# EAGLE design working (EAGLE 6.5.0)
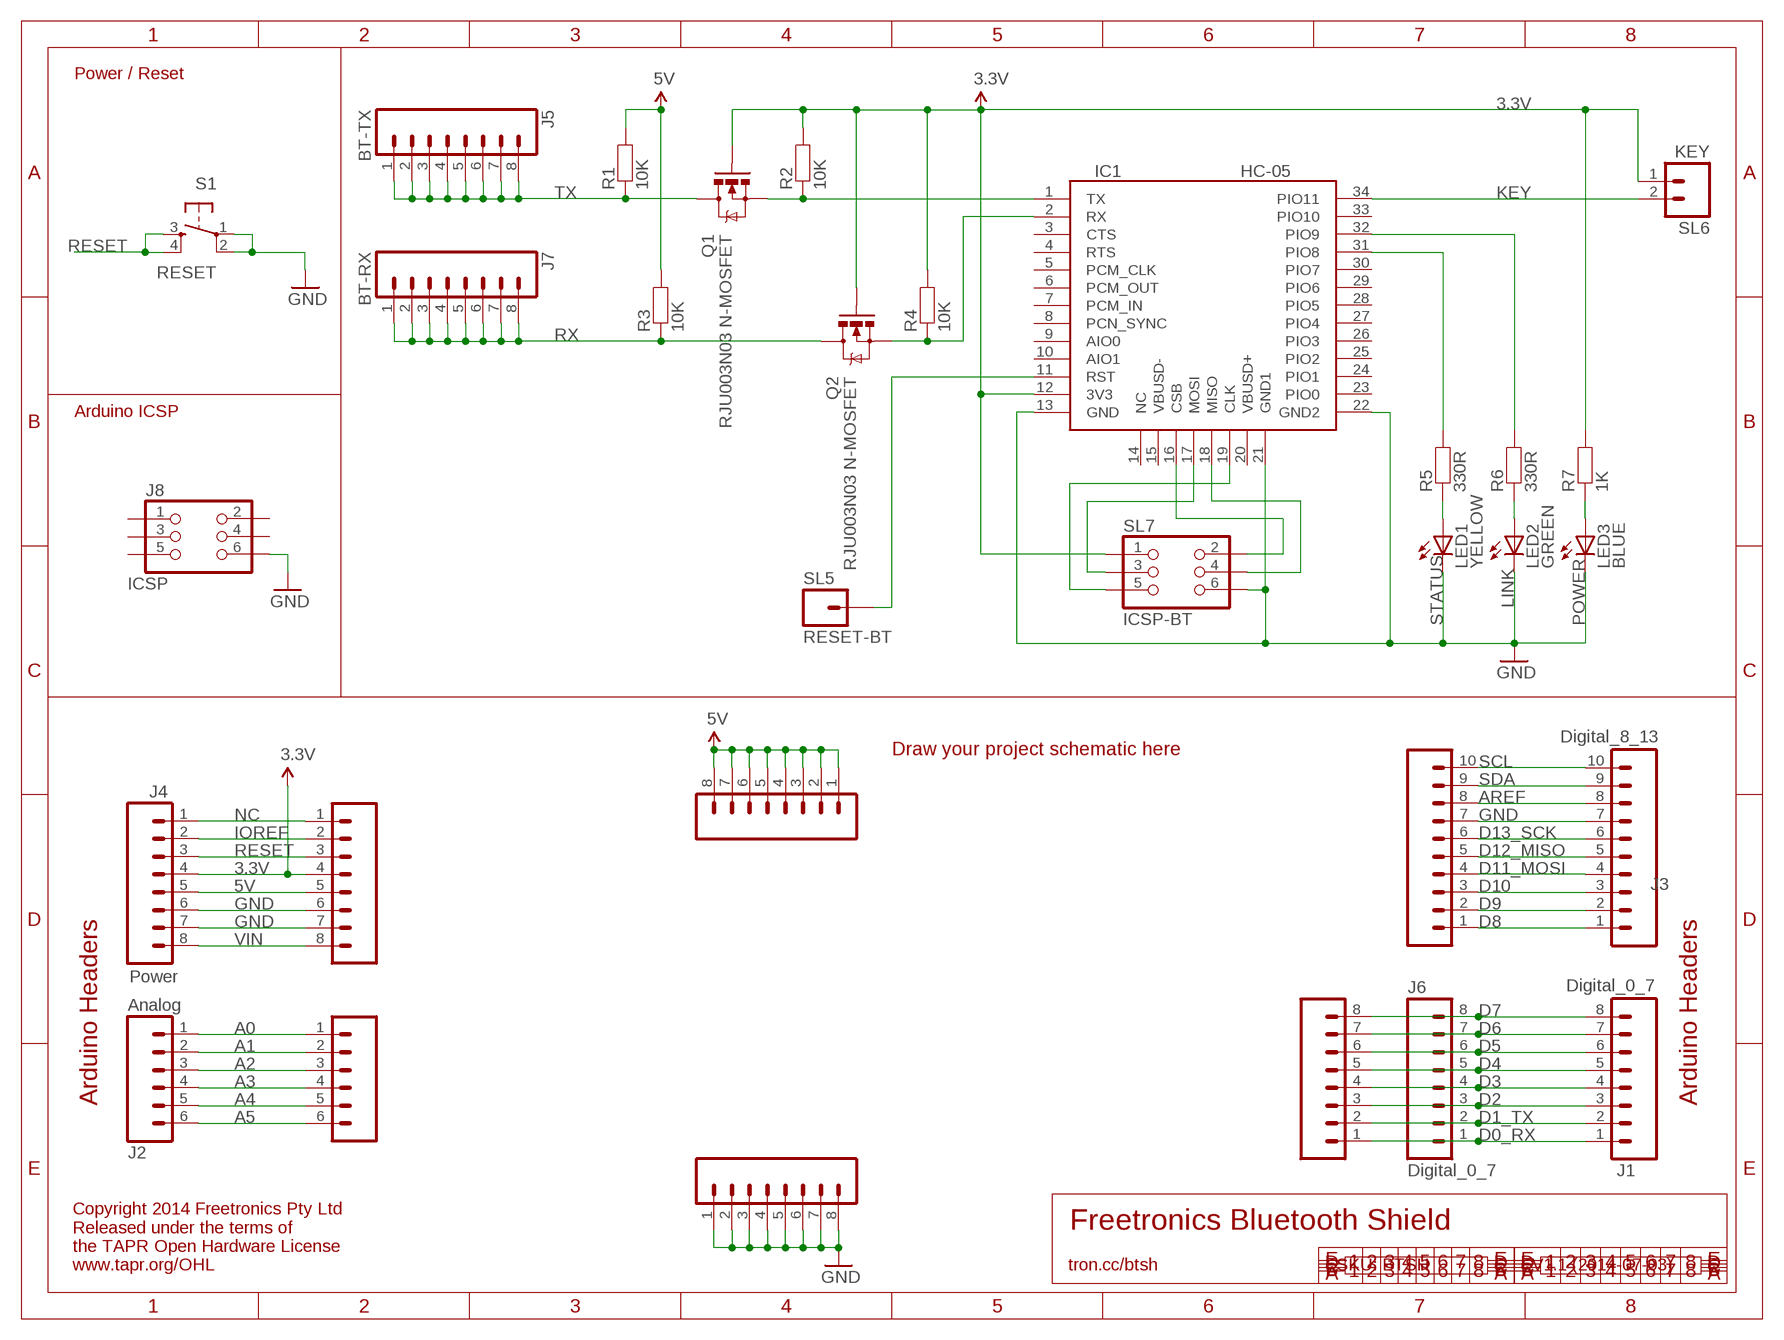
[diagram p0: schematic, sheet 1]

## Parts
IC1  HC-05  HC_05  [BLUETOOTH_SMD]
J1  Digital_0_7  M08  [1X08]
J2  Analog  M06SIP  [1X06]
J3  Digital_8_13  M100.1  [1X10]
J4  Power  M08  [1X08]
J5  BT-TX  M08  [1X08]
J6  Digital_0_7  M08  [1X08]
J7  BT-RX  M08  [1X08]
J8  ICSP  ICSPPTH  [2X03PTH]
LED1  YELLOW  LED0603  [LED-0603]
LED2  GREEN  LED0603  [LED-0603]
LED3  BLUE  LED0603  [LED-0603]
Q1  RJU003N03 N-MOSFET  MOSFET-NSOT-323  [SOT32-3]
Q2  RJU003N03 N-MOSFET  MOSFET-NSOT-323  [SOT32-3]
R1  10K  RESISTOR0603  [0603]
R2  10K  RESISTOR0603  [0603]
R3  10K  RESISTOR0603  [0603]
R4  10K  RESISTOR0603  [0603]
R5  330R  RESISTOR0603  [0603]
R6  330R  RESISTOR0603  [0603]
R7  1K  RESISTOR0603  [0603]
S1  RESET  TAC_SWITCHSMD  [TACTILE_SWITCH_SMD]
SL1  Digital_0_7  M08  [1X08]
SL2  Analog  M06SIP  [1X06]
SL3  Digital_8_13  M100.1  [1X10]
SL4  Power  M08  [1X08]
SL5  RESET-BT  M01PTH  [1X01]
SL6  KEY  M02PTH  [1X02]
SL7  ICSP-BT  ICSPPTH  [2X03PTH]
SL8  5V  M08  [1X08]
SL9  GND  M08  [1X08]

## Nets
3.3V: IC1.12(3V3) J4.4 Q1.1(G) Q2.1(G) R2.2 R4.2 R7.2 SL4.4 SL6.1 SL7.1
5V: J4.5 R1.2 R3.2 SL4.5 SL8.1 SL8.2 SL8.3 SL8.4 SL8.5 SL8.6 SL8.7 SL8.8
A0: J2.1 SL2.1
A1: J2.2 SL2.2
A2: J2.3 SL2.3
A3: J2.4 SL2.4
A4: J2.5 SL2.5
A5: J2.6 SL2.6
AREF: J3.8 SL3.8
D0_RX: J1.1 J6.1 SL1.1
D1_TX: J1.2 J6.2 SL1.2
D2: J1.3 J6.3 SL1.3
D3: J1.4 J6.4 SL1.4
D4: J1.5 J6.5 SL1.5
D5: J1.6 J6.6 SL1.6
D6: J1.7 J6.7 SL1.7
D7: J1.8 J6.8 SL1.8
D8: J3.1 SL3.1
D9: J3.2 SL3.2
D10: J3.3 SL3.3
D11_MOSI: J3.4 SL3.4
D12_MISO: J3.5 SL3.5
D13_SCK: J3.6 SL3.6
GND: IC1.13(GND) IC1.21(GND1) IC1.22(GND2) J3.7 J4.6 J4.7 J8.6 LED1.C LED2.C LED3.C S1.1 S1.2 SL3.7 SL4.6 SL4.7 SL7.6 SL9.1 SL9.2 SL9.3 SL9.4 SL9.5 SL9.6 SL9.7 SL9.8
IOREF: J4.2 SL4.2
KEY: IC1.34(PIO11) SL6.2
N$1: LED1.A R5.1
N$2: LED2.A R6.1
N$3: IC1.16(CSB) SL7.2
N$4: IC1.31(PIO8) R5.2
N$6: IC1.32(PIO9) R6.2
N$14: LED3.A R7.1
N$17: IC1.11(RST) SL5.1
N$21: IC1.17(MOSI) SL7.3
N$37: IC1.18(MISO) SL7.4
N$44: IC1.1(TX) Q1.2(S) R2.1
N$45: IC1.2(RX) Q2.2(S) R4.1
N$46: IC1.19(CLK) SL7.5
NC: J4.1 SL4.1
RESET: J4.3 S1.3 S1.4 SL4.3
RX: J7.1 J7.2 J7.3 J7.4 J7.5 J7.6 J7.7 J7.8 Q2.3(D) R3.1
SCL: J3.10 SL3.10
SDA: J3.9 SL3.9
TX: J5.1 J5.2 J5.3 J5.4 J5.5 J5.6 J5.7 J5.8 Q1.3(D) R1.1
VIN: J4.8 SL4.8
Unconnected: IC1.3(CTS) IC1.4(RTS) IC1.5(PCM_CLK) IC1.6(PCM_OUT) IC1.7(PCM_IN) IC1.8(PCN_SYNC) IC1.9(AIO0) IC1.10(AIO1) IC1.14(NC) IC1.15(VBUSD-) IC1.20(VBUSD+) IC1.23(PIO0) IC1.24(PIO1) IC1.25(PIO2) IC1.26(PIO3) IC1.27(PIO4) IC1.28(PIO5) IC1.29(PIO6) IC1.30(PIO7) IC1.33(PIO10) J8.1 J8.2 J8.3 J8.4 J8.5

## Notes on the sheet
- Power / Reset
- Arduino ICSP
- LINK
- STATUS | POWER
- Draw your project schematic here
- Arduino Headers | Arduino Headers
- Freetronics Bluetooth Shield
- Copyright 2014 Freetronics Pty Ltd
  Released under the terms of
  the TAPR Open Hardware License
  www.tapr.org/OHL
- tron.cc/btsh | SKU: BTSH | V1.1 (2014-07-03)

## Library data of the parts
IC1 = freetronics-jon:HC_05
J1 J4 SL1 SL4 SL8 SL9 = freetronics:M08: Header 8 Standard 8-pin 0.1" header. Use with straight break away headers (SKU : PRT-00116), right angle break away headers (PRT-00553), swiss pins (PRT-00743), machine pins (PRT-00117), and female headers (PRT-00115).
J2 SL2 = freetronics:M06: Header 6 Standard 6-pin 0.1" header. Use with straight break away headers (SKU : PRT-00116), right angle break away headers (PRT-00553), swiss pins (PRT-00743), machine pins (PRT-00117), and female headers (PRT-00115). Molex polarized connector foot print use with SKU : PRT-08094 with associated crimp pins and housings. NOTES ON THE VARIANTS LOCK and LOCK_LONGPADS... This footprint was designed to help hold the alignment of a through-hole component (i.e. 6-pin header) while soldering it into place. You may notice that each hole has been shifted either up or down by 0.005 of an inch from it's more standard position (which is a perfectly straight line). This slight alteration caused the pins (the squares in the middle) to touch the edges of the holes. Because they are alternating, it causes a "brace" to hold the component in place. 0.005 has proven to be the perfect amount of "off-center" position when using our standard breakaway headers. Although looks a little odd when you look at the bare footprint, once you have a header in there, the alteration is very hard to notice. Also, if you push a header all the way into place, it is covered up entirely on the bottom side. This idea of altering the position of holes to aid alignment will be further integrated into the Sparkfun Library for other footprints. It can help hold any component with 3 or more connection pins.
J3 SL3 = freetronics-original:M10: Header 10 Standard 10-pin 0.1" header. Use with straight break away headers (SKU : PRT-00116), right angle break away headers (PRT-00553), swiss pins (PRT-00743), machine pins (PRT-00117), and female headers (PRT-00115).
J5-J7 = freetronics-original:M08: Header 8 Standard 8-pin 0.1" header. Use with straight break away headers (SKU : PRT-00116), right angle break away headers (PRT-00553), swiss pins (PRT-00743), machine pins (PRT-00117), and female headers (PRT-00115).
J8 SL7 = freetronics-jon:ICSP
LED1-LED3 = freetronics-jon:LED: LEDs Standard schematic elements and footprints for 5mm, 3mm, 1206, and 0603 sized LEDs. 5mm - Spark Fun Electronics SKU : COM-00529 (and others)
Q1 Q2 = freetronics-jon:MOSFET-N: Basic N-Channel MOSFET
R1-R7 = freetronics-jon:RESISTOR: Resistor Basic schematic elements and footprints for 0603, 1206, and PTH 1/10th watt (small) resistors.
S1 = freetronics-original:TAC_SWITCH: Momentary Switch Button commonly used for reset or general input. Spark Fun Electronics SKU : COM-00097
SL5 = freetronics-master-v1.1:M01: Header 1 Standard 1-pin 0.1" header. Use with straight break away headers (SKU : PRT-00116), right angle break away headers (PRT-00553), swiss pins (PRT-00743), machine pins (PRT-00117), and female headers (PRT-00115).
SL6 = freetronics-master-v1.1:M02: Header 2 Standard 2-pin 0.1" header. Use with straight break away headers (SKU : PRT-00116), right angle break away headers (PRT-00553), swiss pins (PRT-00743), machine pins (PRT-00117), and female headers (PRT-00115). Molex polarized connector foot print use with SKU : PRT-08233 with associated crimp pins and housings.

## Board
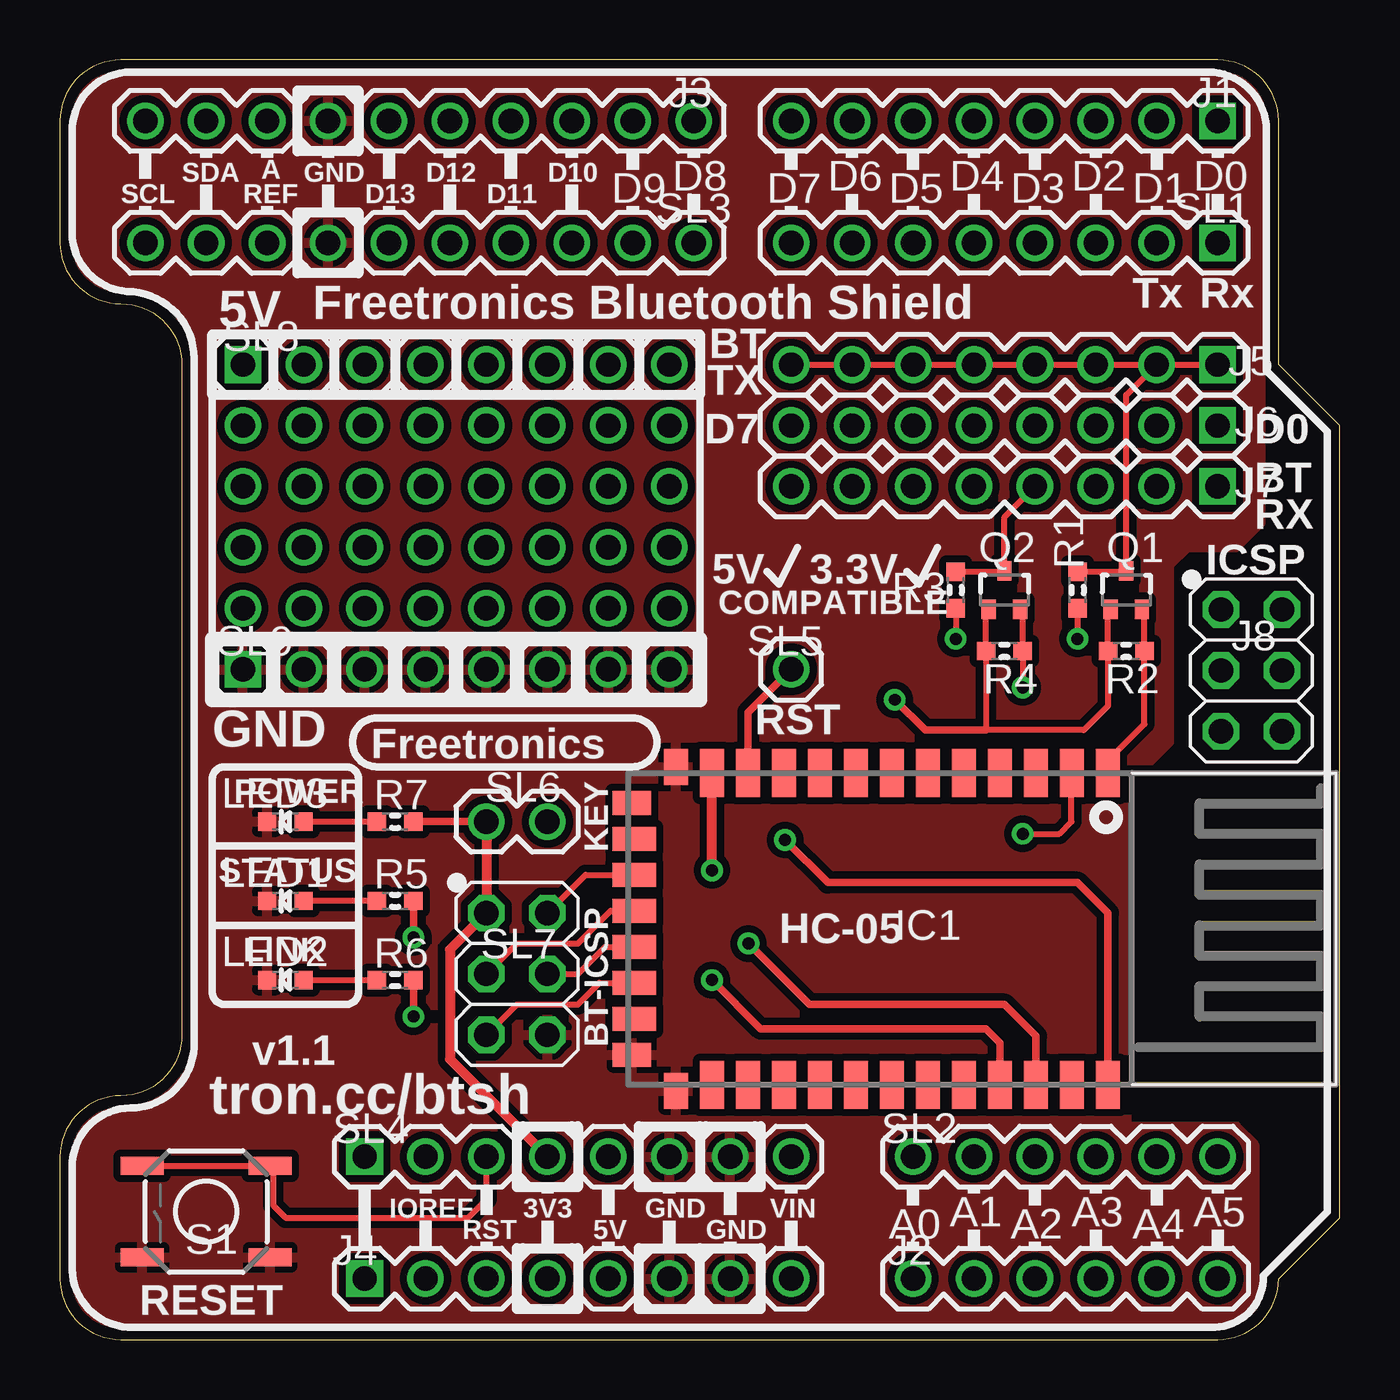
[diagram p1: board, top side]
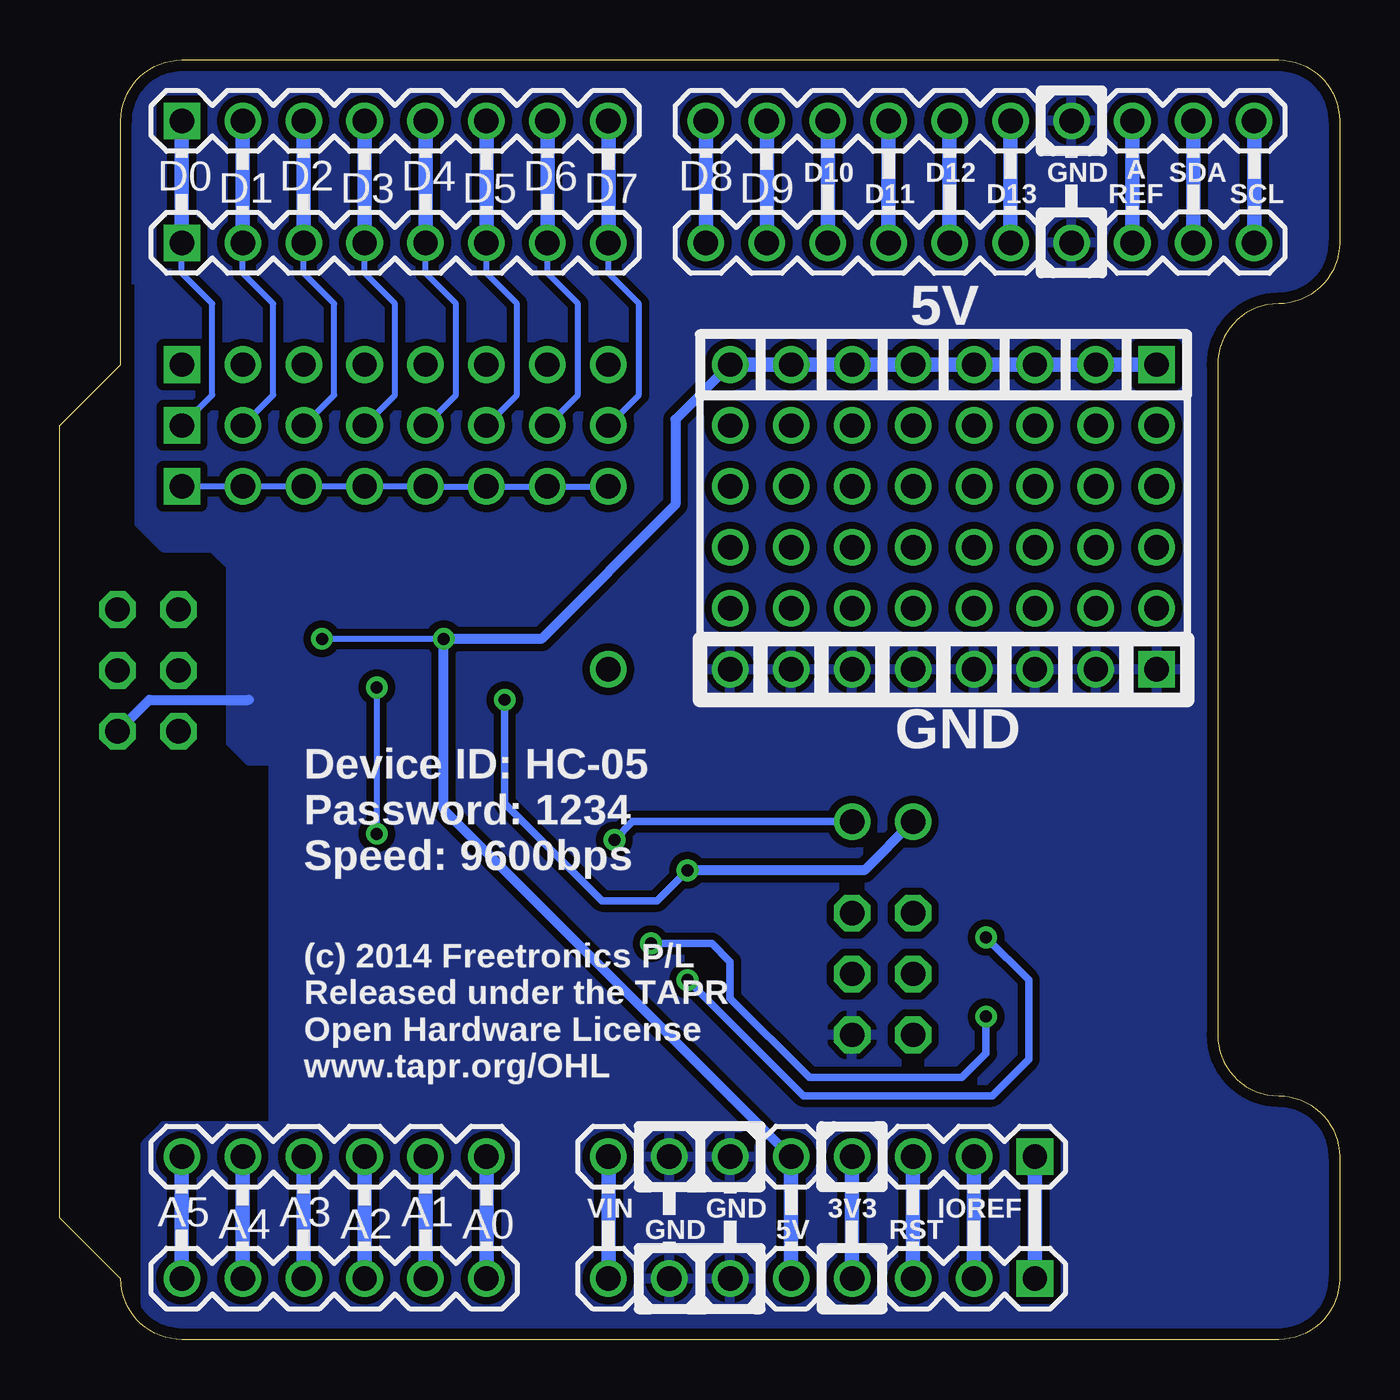
[diagram p2: board, bottom side, seen from below]

Size 53.34 x 53.34 mm. Coordinates in mm from the lower left corner, seen from the top.
Outline: 0,2.54 arc90 2.54,0 48.26,0 arc90 50.8,2.54 53.34,5.08 53.34,38.1 50.8,40.64 50.8,50.8 arc90 48.26,53.34 2.54,53.34 arc90 0,50.8 0,45.72 arc90 2.54,43.18 arc-90 5.08,40.64 5.08,12.7 arc-90 2.54,10.16 arc90 0,7.62 0,2.54
Copper layers (1*16): Top 0.035mm / dielectric 1.5mm / Bottom 0.035mm
Design rules "default *": minimum track width 10mil, minimum drill 24mil, track to track 12mil, track to pad 12mil, pad to pad 12mil, via to via 12mil, smd to smd 8mil, copper to edge 18mil, drill to drill 8mil, minimum pad ring 10mil, minimum via ring 8mil, stop-mask expansion 4mil, vias tented up to drill 0mil, thermal gap 10mil

### Footprints (pad centres in the part's own frame; a part is rotated, then mirrored left to right if it is on the bottom)
BLUETOOTH_SMD = smd 1 x 2: 1 -5.08,-6.35; 2 -3.58,-6.35; 3 -2.08,-6.35; 4 -0.58,-6.35; 5 0.92,-6.35; 6 2.42,-6.35; 7 3.92,-6.35; 8 5.42,-6.35; 9 6.92,-6.35; 10 8.42,-6.35; 11 9.92,-6.35; 12 11.42,-6.35; 23 11.42,6.65; 24 9.92,6.65; 25 8.42,6.65; 26 6.92,6.65; 27 5.42,6.65; 28 3.92,6.65; 29 2.42,6.65; 30 0.92,6.65; 31 -0.58,6.65; 32 -2.08,6.65; 33 -3.58,6.65; 34 -5.08,6.65 | smd 1 x 1.5: 13 12.92,-6.6; 22 12.92,6.9 | smd 1.6 x 1: 14 14.77,-5.1; 21 14.77,5.4 | smd 1.8 x 1: 15 14.67,-3.6; 16 14.67,-2.1; 17 14.67,-0.6; 18 14.67,0.9; 19 14.67,2.4; 20 14.67,3.9
1X08 = drill 1.016 square: 1 0,0 | drill 1.016: 2 2.54,0; 3 5.08,0; 4 7.62,0; 5 10.16,0; 6 12.7,0; 7 15.24,0; 8 17.78,0
1X06 = drill 1.016: 1 0,0; 2 2.54,0; 3 5.08,0; 4 7.62,0; 5 10.16,0; 6 12.7,0
1X10 = drill 1.016: 1 0,0; 2 2.54,0; 3 5.08,0; 4 7.62,0; 5 10.16,0; 6 12.7,0; 7 15.24,0; 8 17.78,0; 9 20.32,0; 10 22.86,0
2X03PTH = drill 1.016 octagon: 1 -2.54,-1.27; 2 -2.54,1.27; 3 0,-1.27; 4 0,1.27; 5 2.54,-1.27; 6 2.54,1.27
LED-0603 = smd 0.762 x 0.762: A -0.762,0; C 0.762,0
SOT32-3 = smd 0.6 x 0.8: 1 -0.65,-0.8; 2 0.65,-0.8; 3 0,0.8
0603 = smd 0.762 x 0.762: 1 -0.762,0; 2 0.762,0
TACTILE_SWITCH_SMD = smd 1.778 x 0.762: 1 -2.667,1.905; 2 2.667,1.905; 3 -2.667,-1.905; 4 2.667,-1.905
1X01 = drill 1.016: 1 0,0
1X02 = drill 1.016: 1 0,0; 2 2.54,0

### Placement (x,y rotation side)
IC1  38.61,17.27 180 top
J1  48.26,50.8 180 top
J2  35.56,2.54 0 top
J3  26.42,50.8 180 top
J4  12.7,2.54 0 top
J5  48.26,40.64 180 top
J6  48.26,38.1 180 top
J7  48.26,35.56 180 top
J8  49.67,27.89 270 top
LED1  9.4,18.29 180 top
LED2  9.4,14.99 180 top
LED3  9.4,21.59 180 top
Q1  44.45,31.24 0 top
Q2  39.37,31.24 0 top
R1  42.42,31.24 270 top
R2  44.45,28.7 180 top
R3  37.34,31.24 270 top
R4  39.37,28.7 180 top
R5  13.97,18.29 0 top
R6  13.97,14.99 0 top
R7  13.97,21.59 0 top
S1  6.1,5.33 180 top
SL1  48.26,45.72 180 top
SL2  35.56,7.62 0 top
SL3  26.42,45.72 180 top
SL4  12.7,7.62 0 top
SL5  30.48,27.94 0 top
SL6  17.78,21.59 0 top
SL7  19.05,15.24 270 top
SL8  7.62,40.64 0 top
SL9  7.62,27.94 0 top

### Tracks (layer width: path | path; a pad name or v marks a point on that pad's centre or on a via)
3.3V  (via drill 0.5)
  Top 0.254: Q1.1 43.69,30.33 R2.2 43.69,26.42 42.67,25.4 38.61,25.4 R4.2 38.61,30.33 Q2.1
  Top 0.305: R7.2 SL6.1 | 38.61,25.4 36.07,25.4 v34.8,26.67
  Top 0.406: SL6.1 SL7.1 16.26,16.26 16.26,11.68 SL4.4 | v27.18,19.56 v27.19,19.57 IC1.12
  Bottom 0.305: v34.8,26.67 34.8,22.35 30.73,18.29 28.45,18.29 v27.18,19.56
  Bottom 0.406: SL6.1 19.81,19.56 v27.18,19.56
  Bottom 0.61: SL4.4 J4.4
5V  (via drill 0.5)
  Top 0.254: R1.2 v42.42,29.21 | R3.2 v37.34,29.21
  Bottom 0.254: v37.34,29.21 v42.42,29.21
  Bottom 0.406: SL4.5 37.34,22.1 v37.34,29.21 33.27,29.21 27.69,34.8 27.69,38.35 SL8.8
  Bottom 0.61: J4.5 SL4.5 | SL8.1 SL8.2 SL8.3 SL8.4 SL8.5 SL8.6 SL8.7 SL8.8
A0
  Bottom 0.61: J2.1 SL2.1
A1
  Bottom 0.61: J2.2 SL2.2
A2
  Bottom 0.61: J2.3 SL2.3
A3
  Bottom 0.61: J2.4 SL2.4
A4
  Bottom 0.61: J2.5 SL2.5
A5
  Bottom 0.61: J2.6 SL2.6
AREF
  Bottom 0.61: SL3.8 J3.8
D0_RX
  Bottom 0.254: J6.1 46.99,39.37 46.99,43.18 48.26,44.45 SL1.1
  Bottom 0.61: SL1.1 J1.1
D1_TX
  Bottom 0.254: J6.2 44.45,39.37 44.45,43.18 45.72,44.45 SL1.2
  Bottom 0.61: SL1.2 J1.2
D2
  Bottom 0.254: J6.3 41.91,39.37 41.91,43.18 43.18,44.45 SL1.3
  Bottom 0.61: SL1.3 J1.3
D3
  Bottom 0.254: J6.4 39.37,39.37 39.37,43.18 40.64,44.45 SL1.4
  Bottom 0.61: SL1.4 J1.4
D4
  Bottom 0.254: J6.5 36.83,39.37 36.83,43.18 38.1,44.45 SL1.5
  Bottom 0.61: SL1.5 J1.5
D5
  Bottom 0.254: J6.6 34.29,39.37 34.29,43.18 35.56,44.45 SL1.6
  Bottom 0.61: SL1.6 J1.6
D6
  Bottom 0.254: J6.7 31.75,39.37 31.75,43.18 33.02,44.45 SL1.7
  Bottom 0.61: SL1.7 J1.7
D7
  Bottom 0.254: J6.8 29.21,39.37 29.21,43.18 30.48,44.45 SL1.8
  Bottom 0.61: SL1.8 J1.8
D8
  Bottom 0.61: SL3.1 J3.1
D9
  Bottom 0.61: SL3.2 J3.2
D10
  Bottom 0.61: SL3.3 J3.3
D11_MOSI
  Bottom 0.61: SL3.4 J3.4
D12_MISO
  Bottom 0.61: SL3.5 J3.5
D13_SCK
  Bottom 0.61: SL3.6 J3.6
GND
  Bottom 0.406: J8.6 49.62,26.67 45.47,26.67
  pour Bottom: 0,50.8 arc-74 2.54,53.34 48.26,53.34 arc-74 50.8,50.8 50.8,44.2 50.04,44.2 50.04,34.04 49.02,33.02 46.99,33.02 46.23,32.26 46.23,24.89 45.47,24.13 44.45,24.13 44.45,8.89 49.02,8.89 49.78,8.13 49.78,1.52 arc-74 48.26,0 2.54,0 arc-74 0,2.54 0,7.62 arc-90 2.54,10.16 arc90 5.08,12.7 5.08,40.64 arc90 2.54,43.18 arc-90 0,45.72
  pour Top: 0,50.8 arc-74 2.54,53.34 48.26,53.34 arc-74 50.8,50.8 50.8,44.2 50.04,44.2 50.04,34.04 49.02,33.02 46.99,33.02 46.23,32.26 46.23,24.89 45.47,24.13 44.45,24.13 44.45,8.89 49.02,8.89 49.78,8.13 49.78,1.52 arc-74 48.26,0 2.54,0 arc-74 0,2.54 0,7.62 arc-90 2.54,10.16 arc90 5.08,12.7 5.08,40.64 arc90 2.54,43.18 arc-90 0,45.72
IOREF
  Bottom 0.61: J4.2 SL4.2
KEY  (via drill 0.5)
  Top 0.305: IC1.34 43.69,17.78 42.42,19.05 32,19.05 v30.23,20.83
  Bottom 0.305: v30.23,20.83 29.46,21.59 SL6.2
N$1
  Top 0.254: R5.1 LED1.A
N$2
  Top 0.254: LED2.A R6.1
N$3
  Top 0.254: SL7.2 21.91,19.37 IC1.16
N$4  (via drill 0.5)
  Top 0.305: IC1.31 39.19,12.37 38.61,12.95 29.21,12.95 v27.18,14.99 | v14.73,16.76 R5.2
  Bottom 0.305: v27.18,14.99 22.35,10.16 14.48,10.16 12.95,11.68 12.95,14.99 v14.73,16.76
N$6  (via drill 0.5)
  Top 0.305: IC1.32 40.69,12.65 39.37,13.97 31.24,13.97 v28.7,16.51 | v14.73,13.46 R6.2
  Bottom 0.305: v28.7,16.51 26.16,16.51 25.4,15.75 25.4,14.22 22.1,10.92 15.75,10.92 14.73,11.94 v14.73,13.46
N$12  (via drill 1.02)
  other vias: 10.16,38.1
N$13  (via drill 1.02)
  other vias: 7.62,38.1
N$14
  Top 0.254: LED3.A R7.1
N$15  (via drill 1.02)
  other vias: 20.32,38.1
N$16  (via drill 1.02)
  other vias: 17.78,38.1
N$17
  Top 0.305: SL5.1 28.69,26.15 IC1.11
N$18  (via drill 1.02)
  other vias: 25.4,30.48
N$19  (via drill 1.02)
  other vias: 22.86,30.48
N$20  (via drill 1.02)
  other vias: 25.4,33.02
N$21
  Top 0.254: SL7.3 19.05,16.51 21.59,16.51 22.95,17.87 IC1.17
N$28  (via drill 1.02)
  other vias: 22.86,33.02
N$29  (via drill 1.02)
  other vias: 25.4,35.56
N$30  (via drill 1.02)
  other vias: 22.86,35.56
N$31  (via drill 1.02)
  other vias: 25.4,38.1
N$32  (via drill 1.02)
  other vias: 22.86,38.1
N$33  (via drill 1.02)
  other vias: 20.32,30.48
N$34  (via drill 1.02)
  other vias: 17.78,30.48
N$35  (via drill 1.02)
  other vias: 20.32,33.02
N$36  (via drill 1.02)
  other vias: 17.78,33.02
N$37
  Top 0.254: SL7.4 21.59,15.24 22.72,16.37 IC1.18
N$44
  Top 0.254: Q1.2 45.21,30.33 R2.1 45.21,25.65 43.69,24.13 IC1.1
N$45  (via drill 0.5)
  Top 0.254: Q2.2 40.13,30.33 R4.1 v40.13,27.18 | v40.13,21.08 41.66,21.08 42.16,21.59 42.16,23.6 IC1.2
  Bottom 0.254: v40.13,27.18 v40.13,21.08
N$46
  Top 0.254: SL7.5 19.05,13.97 21.59,13.97 22.49,14.87 IC1.19
N$47  (via drill 1.02)
  other vias: 20.32,35.56
N$48  (via drill 1.02)
  other vias: 17.78,35.56
N$90  (via drill 1.02)
  other vias: 15.24,30.48
N$91  (via drill 1.02)
  other vias: 12.7,30.48
N$106  (via drill 1.02)
  other vias: 15.24,33.02
N$107  (via drill 1.02)
  other vias: 12.7,33.02
N$122  (via drill 1.02)
  other vias: 15.24,35.56
N$123  (via drill 1.02)
  other vias: 12.7,35.56
N$138  (via drill 1.02)
  other vias: 15.24,38.1
N$139  (via drill 1.02)
  other vias: 12.7,38.1
N$140  (via drill 1.02)
  other vias: 10.16,30.48
N$141  (via drill 1.02)
  other vias: 7.62,30.48
N$156  (via drill 1.02)
  other vias: 10.16,33.02
N$157  (via drill 1.02)
  other vias: 7.62,33.02
N$172  (via drill 1.02)
  other vias: 10.16,35.56
N$173  (via drill 1.02)
  other vias: 7.62,35.56
NC
  Bottom 0.61: J4.1 SL4.1
RESET
  Top 0.254: S1.4 S1.3 8.89,7.11 8.89,5.59 9.4,5.08 17.02,5.08 17.78,5.84 SL4.3
  Bottom 0.61: J4.3 SL4.3
RX
  Top 0.254: R3.1 39.33,32 Q2.3 39.37,34.29 J7.4
  Bottom 0.254: J7.1 J7.2 J7.3 J7.4 J7.5 J7.6 J7.7 J7.8
SCL
  Bottom 0.61: J3.10 SL3.10
SDA
  Bottom 0.61: J3.9 SL3.9
TX
  Top 0.254: J5.8 J5.7 J5.6 J5.5 J5.4 J5.3 J5.2 | J5.2 J5.1 | R1.1 44.45,32 Q1.3 44.45,39.37 J5.2
VIN
  Bottom 0.61: SL4.8 J4.8

### Text on the board
tPlace: SDA | A | GND | D12 | D10 | D8 | D6 | D4 | D2 | D0 | SCL | REF | D13 | D11 | D9 | D7 | D5 | D3 | D1 | Freetronics Bluetooth Shield | Tx | Rx | 5V | BT | TX | D7 | D0 | BT | RX | ICSP | 5V | 3.3V | COMPATIBLE | GND | RST | Freetronics | POWER | KEY | STATUS | HC-05 | LINK | BT-ICSP | v1.1 | tron.cc/btsh | IOREF | 3V3 | GND | VIN | A1 | A3 | A5 | RST | 5V | GND | A0 | A2 | A4 | RESET
bPlace: SDA | A | GND | D12 | D10 | D8 | D6 | D4 | D2 | D0 | SCL | REF | D13 | D11 | D9 | D7 | D5 | D3 | D1 | 5V | GND | Device ID: HC-05 / Password: 1234 / Speed: 9600bps | (c) 2014 Freetronics P/L / Released under the TAPR / Open Hardware License / www.tapr.org/OHL | IOREF | 3V3 | GND | VIN | A1 | A3 | A5 | RST | 5V | GND | A0 | A2 | A4
tValues: HC-05
tDocu: K | A | K | A | K | A